# EAGLE schematic ViaCar Main (EAGLE 5.11)

## Sheet 1 of 2
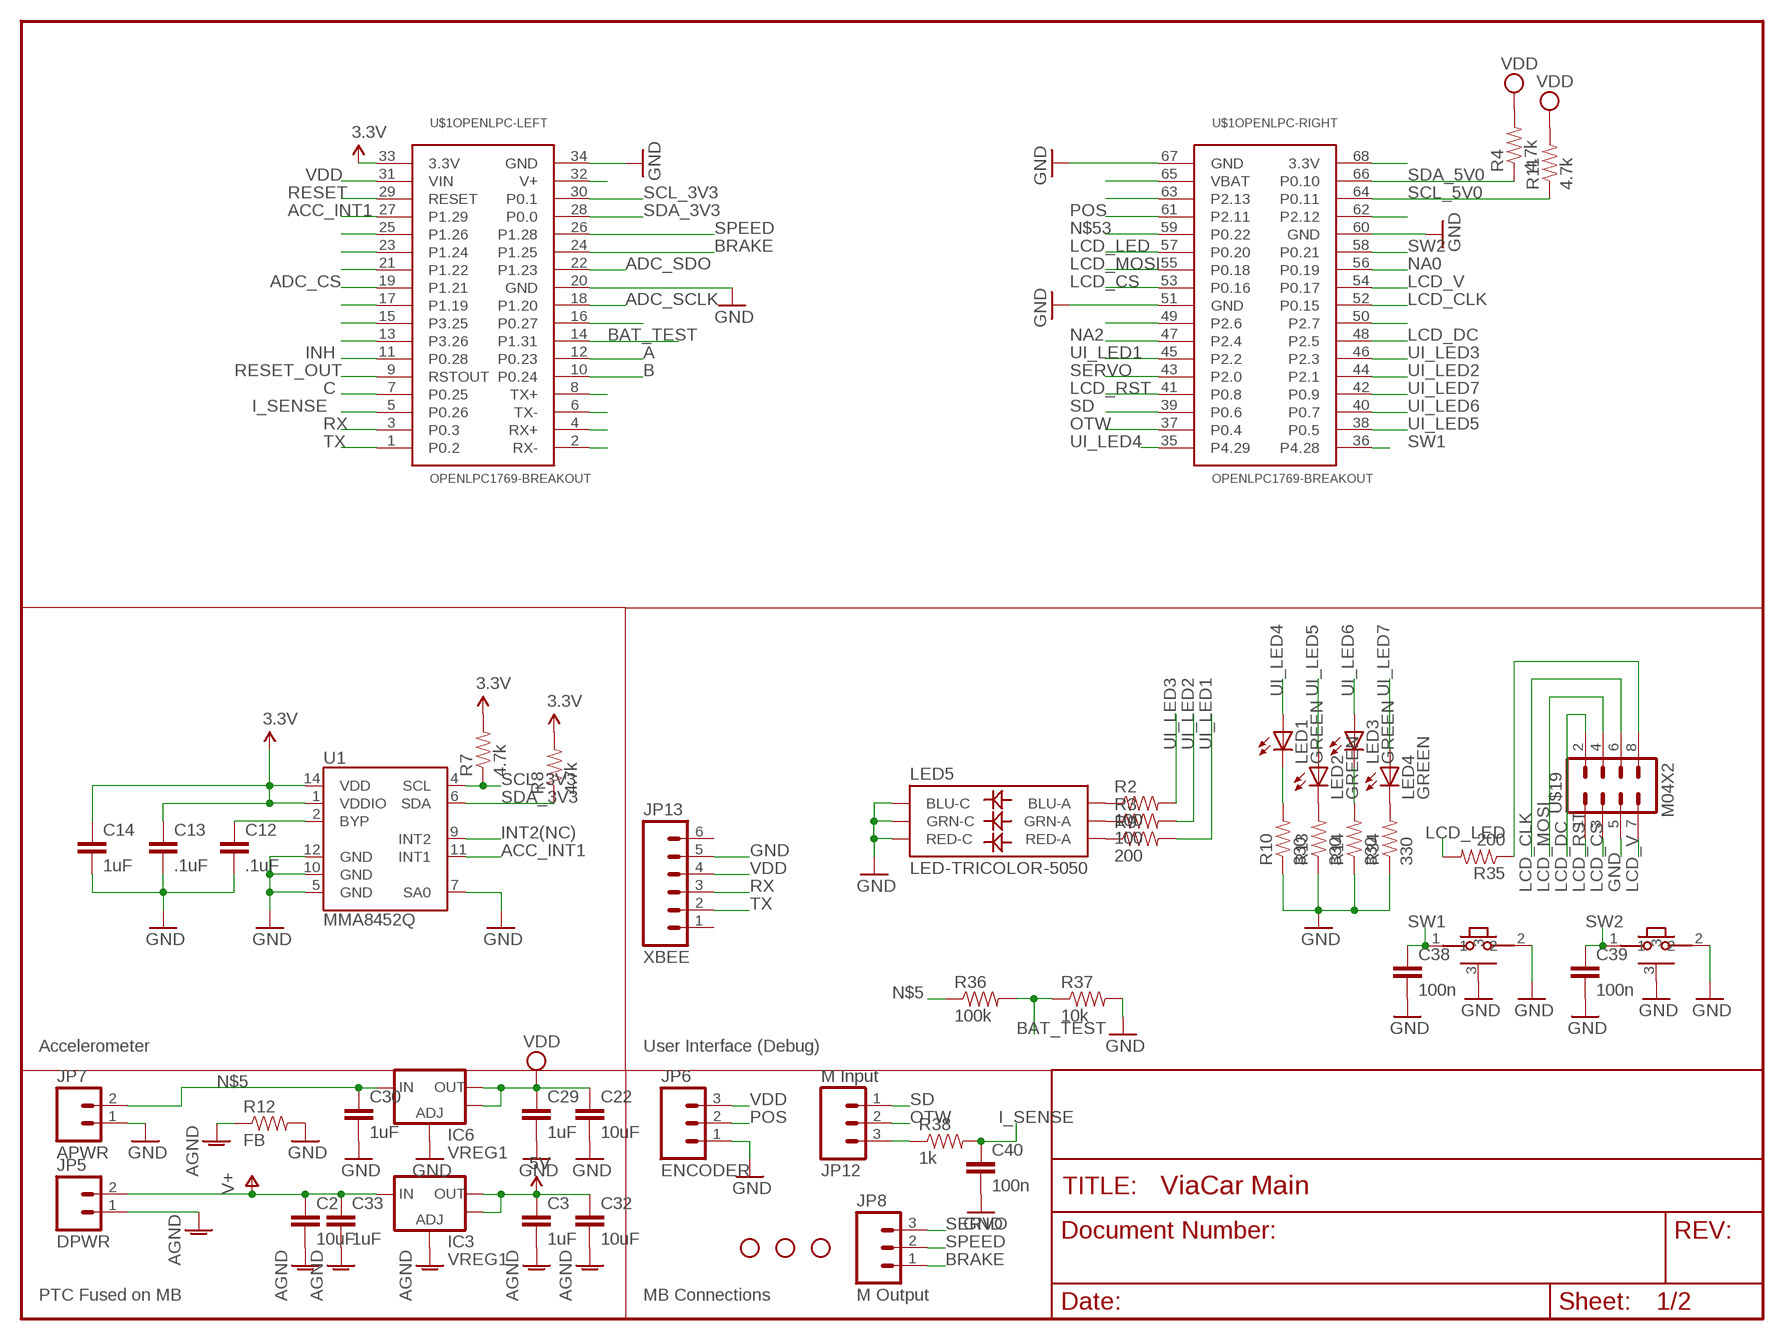
[diagram p0: schematic, sheet 1]

### Parts
C2  10uF  CAP0805  [0805]
C3  1uF  CAP0805  [0805]
C12  .1uF  CAP0603-CAP  [0603-CAP]
C13  .1uF  CAP0603-CAP  [0603-CAP]
C14  1uF  CAP0805  [0805]
C22  10uF  CAP1206  [1206]
C29  1uF  CAP0805  [0805]
C30  1uF  CAP0805  [0805]
C32  10uF  CAP1206  [1206]
C33  1uF  CAP1206  [1206]
C38  100n  CAP0603-CAP  [0603-CAP]
C39  100n  CAP0603-CAP  [0603-CAP]
C40  100n  CAP0603-CAP  [0603-CAP]
IC3  VREG1  V_REG_LM1117SOT223  [SOT223]
IC6  VREG1  V_REG_LM1117SOT223  [SOT223]
JP5  DPWR  M02POLAR  [MOLEX-1X2]
JP6  ENCODER  M03POLAR  [MOLEX-1X3]
JP7  APWR  M02POLAR  [MOLEX-1X2]
JP8  M Output  M03POLAR  [MOLEX-1X3]
JP10  STAND-OFF  [STAND-OFF]
JP11  STAND-OFF  [STAND-OFF]
JP12  M Input  M03POLAR  [MOLEX-1X3]
JP13  XBEE  M06SIP  [1X06]
JP14  STAND-OFF  [STAND-OFF]
LED1  GREEN  LED0603  [LED-0603]
LED2  GREEN  LED0603  [LED-0603]
LED3  GREEN  LED0603  [LED-0603]
LED4  GREEN  LED0603  [LED-0603]
LED5  LED-TRICOLOR-5050  [LED-TRICOLOR-5050]
R2  100  RESISTOR0603-RES  [0603-RES]
R3  100  RESISTOR0603-RES  [0603-RES]
R4  4.7k  RESISTOR0603-RES  [0603-RES]
R7  4.7k  RESISTOR0603-RES  [0603-RES]
R8  4.7k  RESISTOR0603-RES  [0603-RES]
R9  200  RESISTOR0603-RES  [0603-RES]
R10  330  RESISTOR0603-RES  [0603-RES]
R11  4.7k  RESISTOR0603-RES  [0603-RES]
R12  FB  RESISTOR0603-RES  [0603-RES]
R13  330  RESISTOR0603-RES  [0603-RES]
R14  330  RESISTOR0603-RES  [0603-RES]
R34  330  RESISTOR0603-RES  [0603-RES]
R35  200  RESISTOR0603-RES  [0603-RES]
R36  100k  RESISTOR0603-RES  [0603-RES]
R37  10k  RESISTOR0603-RES  [0603-RES]
R38  1k  RESISTOR0603-RES  [0603-RES]
U1  MMA8452Q  [QFN-16_0.5MM]
U$1  OPENLPC1769-BREAKOUT  [OPENLPC1769-BREAKOUT]
U$11  B3U-3100P  [B3U-3100P]
U$12  B3U-3100P  [B3U-3100P]
U$19  M04X2  [2X4]

### Nets
3.3V: C13.1 C14.1 R7.2 R8.2 U1.1(VDDIO) U1.14(VDD) U$1.33(OPENLPC-LEFT:3.3V)
5V: C3.1 C32.1 IC3.2(OUT) IC3.4(OUT) ; also sheet 2
A: U$1.12(OPENLPC-LEFT:P0.23) ; also sheet 2
ACC_INT1: U1.11(INT1) U$1.27(OPENLPC-LEFT:P1.29)
ADC_CS: U$1.19(OPENLPC-LEFT:P1.21) ; also sheet 2
ADC_SCLK: U$1.18(OPENLPC-LEFT:P1.20) ; also sheet 2
ADC_SDO: U$1.22(OPENLPC-LEFT:P1.23) ; also sheet 2
AGND: C2.2 C3.2 C32.2 C33.2 IC3.1(ADJ) JP5.1 R12.1 ; also sheet 2
B: U$1.10(OPENLPC-LEFT:P0.24) ; also sheet 2
BAT_TEST: R36.2 R37.1 U$1.14(OPENLPC-LEFT:P1.31)
BRAKE: JP8.1 U$1.24(OPENLPC-LEFT:P1.25)
C: U$1.7(OPENLPC-LEFT:P0.25) ; also sheet 2
GND: C12.2 C13.2 C14.2 C22.2 C29.2 C30.2 C38.2 C39.2 C40.2 IC6.1(ADJ) JP6.1 JP7.1 JP13.5 LED5.4(BLU-C) LED5.5(RED-C) LED5.6(GRN-C) R10.1 R12.2 R13.1 R14.1 R34.1 R37.2 U1.5(GND) U1.7(SA0) U1.10(GND) U1.12(GND) U$1.20(OPENLPC-LEFT:GND) U$1.34(OPENLPC-LEFT:GND) U$1.51(OPENLPC-RIGHT:GND) U$1.60(OPENLPC-RIGHT:GND) U$1.67(OPENLPC-RIGHT:GND) U$11.2 U$11.3 U$12.2 U$12.3 U$19.5
I_SENSE: C40.1 R38.2 U$1.5(OPENLPC-LEFT:P0.26)
INH: U$1.11(OPENLPC-LEFT:P0.28) ; also sheet 2
INT2(NC): U1.9(INT2)
LCD_CLK: U$1.52(OPENLPC-RIGHT:P0.15) U$19.6
LCD_CS: U$1.53(OPENLPC-RIGHT:P0.16) U$19.3
LCD_DC: U$1.48(OPENLPC-RIGHT:P2.5) U$19.2
LCD_LED: R35.2 U$1.57(OPENLPC-RIGHT:P0.20)
LCD_MOSI: U$1.55(OPENLPC-RIGHT:P0.18) U$19.4
LCD_RST: U$1.41(OPENLPC-RIGHT:P0.8) U$19.1
LCD_V: U$1.54(OPENLPC-RIGHT:P0.17) U$19.7
N$1: U$1.68(OPENLPC-RIGHT:3.3V)
N$3: LED5.3(BLU-A) R2.1
N$4: LED5.1(GRN-A) R3.1
N$5: C30.1 IC6.3(IN) JP7.2 R36.1
N$6: LED5.2(RED-A) R9.1
N$7: JP12.3 R38.1
N$8: LED1.C R10.2
N$14: LED2.C R13.2
N$15: C12.1 U1.2(BYP)
N$16: LED3.C R14.2
N$17: LED4.C R34.2
N$24: R35.1 U$19.8
N$37: U$1.49(OPENLPC-RIGHT:P2.6)
N$42: U$1.50(OPENLPC-RIGHT:P2.7)
N$47: U$1.62(OPENLPC-RIGHT:P2.12)
N$50: U$1.65(OPENLPC-RIGHT:VBAT)
N$51: U$1.63(OPENLPC-RIGHT:P2.13)
N$53: U$1.59(OPENLPC-RIGHT:P0.22)
N$59: U$1.25(OPENLPC-LEFT:P1.26)
N$60: U$1.23(OPENLPC-LEFT:P1.24)
N$61: U$1.21(OPENLPC-LEFT:P1.22)
N$63: U$1.17(OPENLPC-LEFT:P1.19)
N$64: U$1.15(OPENLPC-LEFT:P3.25)
N$65: U$1.13(OPENLPC-LEFT:P3.26)
N$72: U$1.2(OPENLPC-LEFT:RX-)
N$73: U$1.4(OPENLPC-LEFT:RX+)
N$74: U$1.6(OPENLPC-LEFT:TX-)
N$75: U$1.8(OPENLPC-LEFT:TX+)
N$79: U$1.16(OPENLPC-LEFT:P0.27)
N$86: U$1.32(OPENLPC-LEFT:V+)
NA0: U$1.56(OPENLPC-RIGHT:P0.19)
NA2: U$1.47(OPENLPC-RIGHT:P2.4)
OTW: JP12.2 U$1.37(OPENLPC-RIGHT:P0.4)
POS: JP6.2 U$1.61(OPENLPC-RIGHT:P2.11)
RESET: U$1.29(OPENLPC-LEFT:RESET)
RESET_OUT: U$1.9(OPENLPC-LEFT:RSTOUT)
RX: JP13.3 U$1.3(OPENLPC-LEFT:P0.3)
SCL_3V3: R7.1 U1.4(SCL) U$1.30(OPENLPC-LEFT:P0.1)
SCL_5V0: R11.1 U$1.64(OPENLPC-RIGHT:P0.11) ; also sheet 2
SD: JP12.1 U$1.39(OPENLPC-RIGHT:P0.6)
SDA_3V3: R8.1 U1.6(SDA) U$1.28(OPENLPC-LEFT:P0.0)
SDA_5V0: R4.1 U$1.66(OPENLPC-RIGHT:P0.10) ; also sheet 2
SERVO: JP8.3 U$1.43(OPENLPC-RIGHT:P2.0)
SPEED: JP8.2 U$1.26(OPENLPC-LEFT:P1.28)
SW1: C38.1 U$1.36(OPENLPC-RIGHT:P4.28) U$11.1
SW2: C39.1 U$1.58(OPENLPC-RIGHT:P0.21) U$12.1
TX: JP13.2 U$1.1(OPENLPC-LEFT:P0.2)
UI_LED1: R9.2 U$1.45(OPENLPC-RIGHT:P2.2)
UI_LED2: R3.2 U$1.44(OPENLPC-RIGHT:P2.1)
UI_LED3: R2.2 U$1.46(OPENLPC-RIGHT:P2.3)
UI_LED4: LED1.A U$1.35(OPENLPC-RIGHT:P4.29)
UI_LED5: LED2.A U$1.38(OPENLPC-RIGHT:P0.5)
UI_LED6: LED3.A U$1.40(OPENLPC-RIGHT:P0.7)
UI_LED7: LED4.A U$1.42(OPENLPC-RIGHT:P0.9)
V+: C2.1 C33.1 IC3.3(IN) JP5.2 ; also sheet 2
VDD: C22.1 C29.1 IC6.2(OUT) IC6.4(OUT) JP6.3 JP13.4 R4.2 R11.2 U$1.31(OPENLPC-LEFT:VIN)
Unconnected: JP13.1 JP13.6

### Notes on the sheet
- Accelerometer | User Interface (Debug)
- PTC Fused on MB | MB Connections

## Sheet 2 of 2
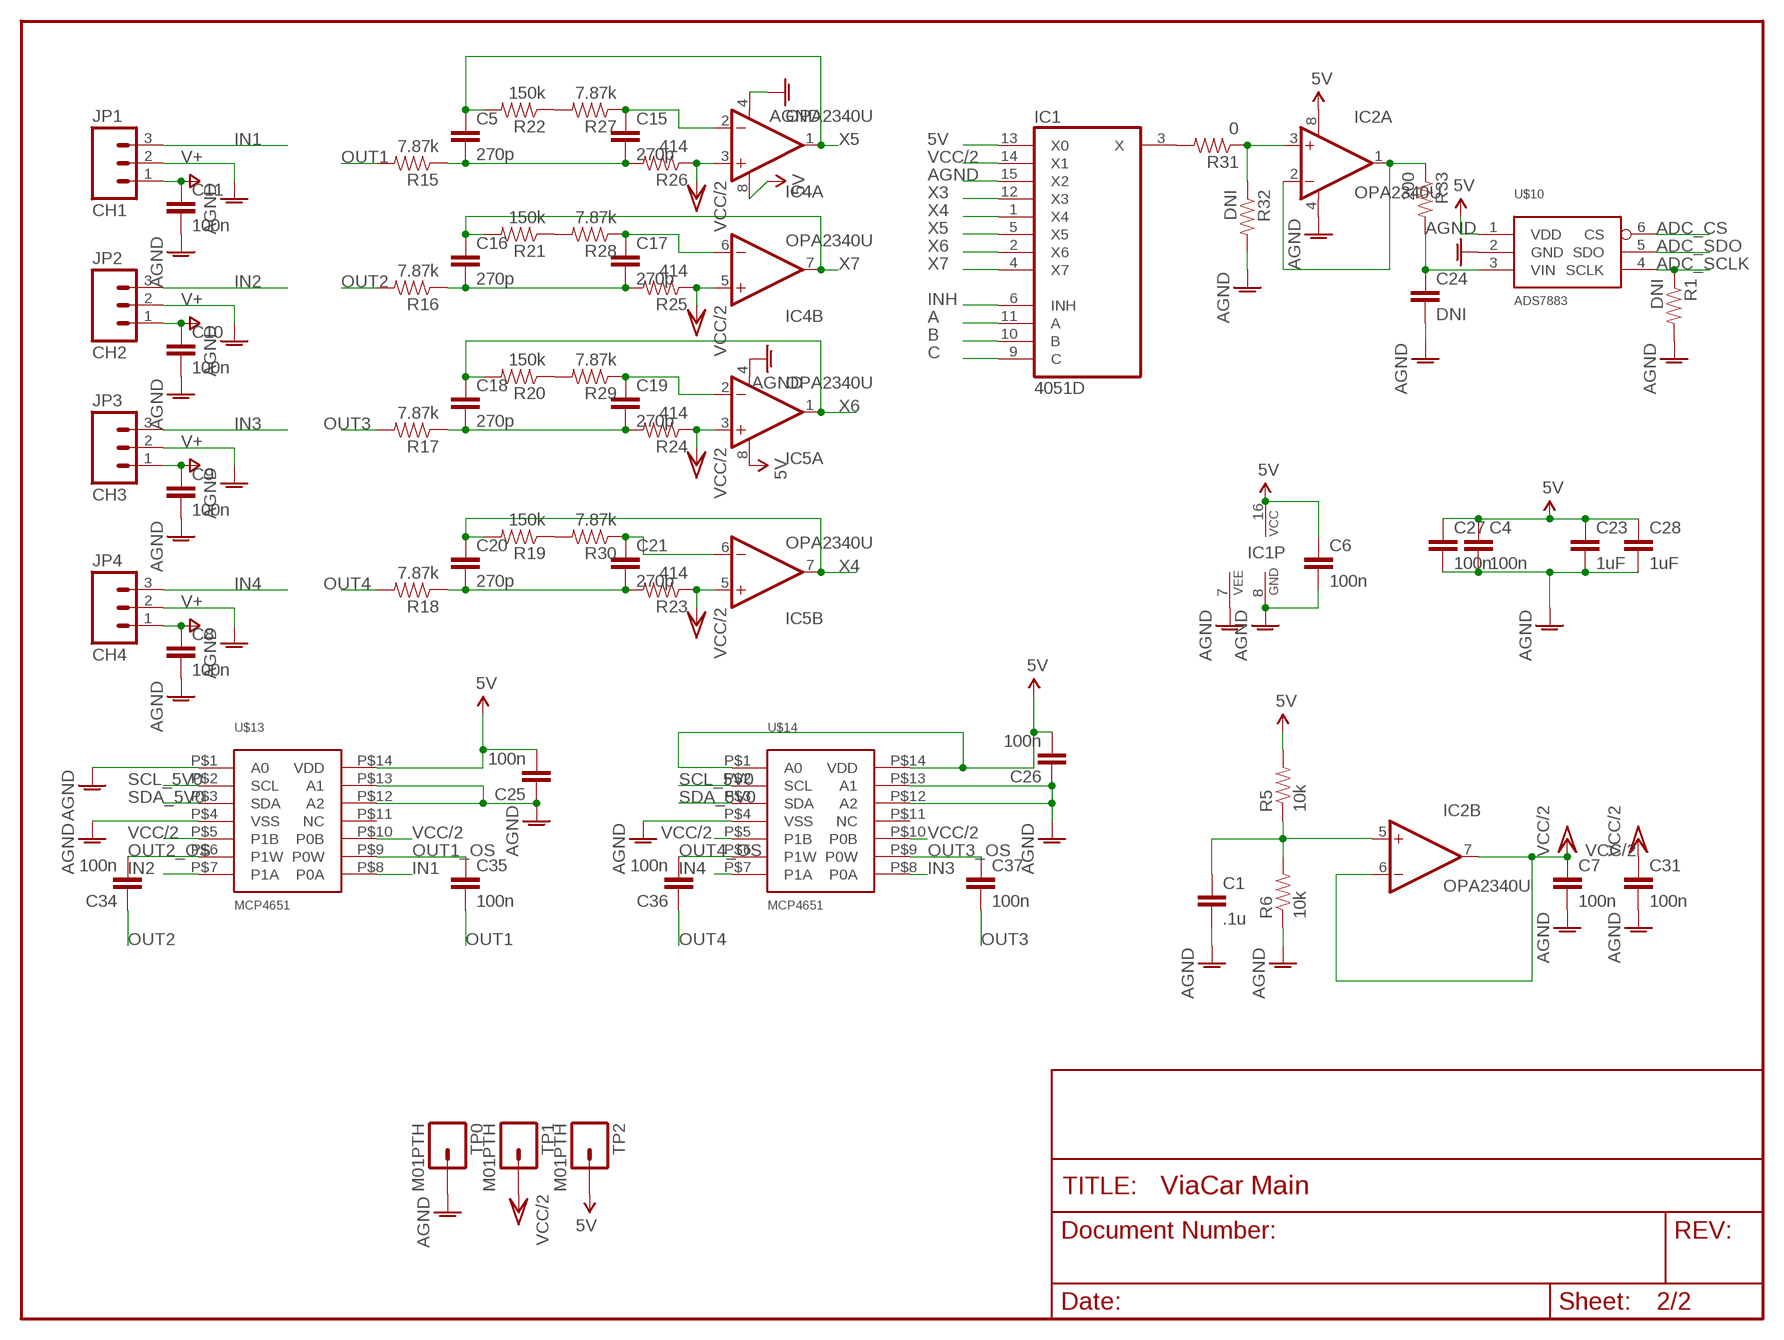
[diagram p1: schematic, sheet 2]

### Parts
C1  .1u  CAP0603-CAP  [0603-CAP]
C4  100n  CAP0603-CAP  [0603-CAP]
C5  270p  CAP0603-CAP  [0603-CAP]
C6  100n  CAP0603-CAP  [0603-CAP]
C7  100n  CAP0603-CAP  [0603-CAP]
C8  100n  CAP0603-CAP  [0603-CAP]
C9  100n  CAP0603-CAP  [0603-CAP]
C10  100n  CAP0603-CAP  [0603-CAP]
C11  100n  CAP0603-CAP  [0603-CAP]
C15  270p  CAP0603-CAP  [0603-CAP]
C16  270p  CAP0603-CAP  [0603-CAP]
C17  270p  CAP0603-CAP  [0603-CAP]
C18  270p  CAP0603-CAP  [0603-CAP]
C19  270p  CAP0603-CAP  [0603-CAP]
C20  270p  CAP0603-CAP  [0603-CAP]
C21  270p  CAP0603-CAP  [0603-CAP]
C23  1uF  CAP0805  [0805]
C24  DNI  CAP0603-CAP  [0603-CAP]
C25  100n  CAP0603-CAP  [0603-CAP]
C26  100n  CAP0603-CAP  [0603-CAP]
C27  100n  CAP0603-CAP  [0603-CAP]
C28  1uF  CAP0805  [0805]
C31  100n  CAP0603-CAP  [0603-CAP]
C34  100n  CAP0603-CAP  [0603-CAP]
C35  100n  CAP0603-CAP  [0603-CAP]
C36  100n  CAP0603-CAP  [0603-CAP]
C37  100n  CAP0603-CAP  [0603-CAP]
IC1  4051D  [SO16]
IC2  OPA2340U  [SO08]
IC4  OPA2340U  [SO08]
IC5  OPA2340U  [SO08]
JP1  CH1  M03POLAR  [MOLEX-1X3]
JP2  CH2  M03POLAR  [MOLEX-1X3]
JP3  CH3  M03POLAR  [MOLEX-1X3]
JP4  CH4  M03POLAR  [MOLEX-1X3]
R1  DNI  RESISTOR0603-RES  [0603-RES]
R5  10k  RESISTOR0603-RES  [0603-RES]
R6  10k  RESISTOR0603-RES  [0603-RES]
R15  7.87k  RESISTOR0603-RES  [0603-RES]
R16  7.87k  RESISTOR0603-RES  [0603-RES]
R17  7.87k  RESISTOR0603-RES  [0603-RES]
R18  7.87k  RESISTOR0603-RES  [0603-RES]
R19  150k  RESISTOR0603-RES  [0603-RES]
R20  150k  RESISTOR0603-RES  [0603-RES]
R21  150k  RESISTOR0603-RES  [0603-RES]
R22  150k  RESISTOR0603-RES  [0603-RES]
R23  414  RESISTOR0603-RES  [0603-RES]
R24  414  RESISTOR0603-RES  [0603-RES]
R25  414  RESISTOR0603-RES  [0603-RES]
R26  414  RESISTOR0603-RES  [0603-RES]
R27  7.87k  RESISTOR0603-RES  [0603-RES]
R28  7.87k  RESISTOR0603-RES  [0603-RES]
R29  7.87k  RESISTOR0603-RES  [0603-RES]
R30  7.87k  RESISTOR0603-RES  [0603-RES]
R31  0  RESISTOR0603-RES  [0603-RES]
R32  DNI  RESISTOR0603-RES  [0603-RES]
R33  200  RESISTOR0603-RES  [0603-RES]
TP0  M01PTH  [1X01]
TP1  M01PTH  [1X01]
TP2  M01PTH  [1X01]
U$10  ADS7883  [SOT-23-6]
U$13  MCP4651  [MCP-TSSOP-14]
U$14  MCP4651  [MCP-TSSOP-14]

### Nets
5V: C4.1 C6.1 C23.1 C25.2 C26.2 C27.1 C28.1 IC1.13(X0) IC1.16(VCC) IC2.8(A:V+) IC4.8(A:V+) IC5.8(A:V+) R5.2 TP2.1 U$10.1(VDD) U$13.P$14(VDD) U$14.P$1(A0) U$14.P$14(VDD) ; also sheet 1
A: IC1.11(A) ; also sheet 1
ADC_CS: U$10.6(CS) ; also sheet 1
ADC_SCLK: R1.1 U$10.4(SCLK) ; also sheet 1
ADC_SDO: U$10.5(SDO) ; also sheet 1
AGND: C1.2 C4.2 C6.2 C7.2 C8.2 C9.2 C10.2 C11.2 C23.2 C24.2 C25.1 C26.1 C27.2 C28.2 C31.2 IC1.7(VEE) IC1.8(GND) IC1.15(X2) IC2.4(A:V-) IC4.4(A:V-) IC5.4(A:V-) JP1.2 JP2.2 JP3.2 JP4.2 R1.2 R6.1 R32.2 TP0.1 U$10.2(GND) U$13.P$1(A0) U$13.P$4(VSS) U$13.P$12(A2) U$13.P$13(A1) U$14.P$4(VSS) U$14.P$12(A2) U$14.P$13(A1) ; also sheet 1
B: IC1.10(B) ; also sheet 1
C: IC1.9(C) ; also sheet 1
IN1: JP1.3 U$13.P$8(P0A)
IN2: JP2.3 U$13.P$7(P1A)
IN3: JP3.3 U$14.P$8(P0A)
IN4: JP4.3 U$14.P$7(P1A)
INH: IC1.6(INH) ; also sheet 1
N$2: IC2.3(A:+IN) R31.1 R32.1
N$10: C1.1 IC2.5(B:+IN) R5.1 R6.2
N$20: C15.1 IC4.2(A:-IN) R27.1
N$21: C5.2 C15.2 R15.1 R26.2
N$22: C16.2 C17.2 R16.1 R25.2
N$23: C17.1 IC4.6(B:-IN) R28.1
N$25: C18.2 C19.2 R17.1 R24.2
N$27: C19.1 IC5.2(A:-IN) R29.1
N$28: C20.2 C21.2 R18.1 R23.2
N$29: C21.1 IC5.6(B:-IN) R30.1
N$31: IC1.3(X) R31.2
N$32: IC2.1(A:OUT) IC2.2(A:-IN) R33.1
N$33: R22.1 R27.2
N$34: R21.1 R28.2
N$35: R20.1 R29.2
N$36: R19.1 R30.2
N$38: C24.1 R33.2 U$10.3(VIN)
OUT1: C35.2 R15.2
OUT1_OS: C35.1 U$13.P$9(P0W)
OUT2: C34.1 R16.2
OUT2_OS: C34.2 U$13.P$6(P1W)
OUT3: C37.2 R17.2
OUT3_OS: C37.1 U$14.P$9(P0W)
OUT4: C36.1 R18.2
OUT4_OS: C36.2 U$14.P$6(P1W)
SCL_5V0: U$13.P$2(SCL) U$14.P$2(SCL) ; also sheet 1
SDA_5V0: U$13.P$3(SDA) U$14.P$3(SDA) ; also sheet 1
V+: C8.1 C9.1 C10.1 C11.1 JP1.1 JP2.1 JP3.1 JP4.1 ; also sheet 1
VCC/2: C7.1 C31.1 IC1.14(X1) IC2.6(B:-IN) IC2.7(B:OUT) IC4.3(A:+IN) IC4.5(B:+IN) IC5.3(A:+IN) IC5.5(B:+IN) R23.1 R24.1 R25.1 R26.1 TP1.1 U$13.P$5(P1B) U$13.P$10(P0B) U$14.P$5(P1B) U$14.P$10(P0B)
X3: IC1.12(X3)
X4: C20.1 IC1.1(X4) IC5.7(B:OUT) R19.2
X5: C5.1 IC1.5(X5) IC4.1(A:OUT) R22.2
X6: C18.1 IC1.2(X6) IC5.1(A:OUT) R20.2
X7: C16.1 IC1.4(X7) IC4.7(B:OUT) R21.2
Unconnected: U$13.P$11(NC) U$14.P$11(NC)

## Library data of the parts
C1-C40 = SparkFun:CAP: Capacitor Standard 0603 ceramic capacitor, and 0.1" leaded capacitor.
IC1 = 40xx:4051: 8-channel ANALOG MULTIPLEXER
IC2 IC4 IC5 = burr-brown:OPA2340: Single-Supply, Rail-to-Rail Operational Amplifiers MicroAmplifier(TM) Series; Product Folder:OPA2340; MF: TEXAS INSTRUMENTS; MPN: OPA2340UA; OC_FARNELL: 1101541; OC_NEWARK: 36K7581
IC3 IC6 = SparkFun:V_REG_LM1117: Voltage Regulator LM1117 Standard adjustable voltage regulator but in SMD form. Spark Fun Electronics SKU : COM-00595
JP1-JP4 JP6 JP8 JP12 = SparkFun:M03: Header 3 Standard 3-pin 0.1" header. Use with straight break away headers (SKU : PRT-00116), right angle break away headers (PRT-00553), swiss pins (PRT-00743), machine pins (PRT-00117), and female headers (PRT-00115). Molex polarized connector foot print use with SKU : PRT-08232 with associated crimp pins and housings.
JP5 JP7 = SparkFun:M02: Header 2 Standard 2-pin 0.1" header. Use with straight break away headers (SKU : PRT-00116), right angle break away headers (PRT-00553), swiss pins (PRT-00743), machine pins (PRT-00117), and female headers (PRT-00115). Molex polarized connector foot print use with SKU : PRT-08233 with associated crimp pins and housings.
JP10 JP11 JP14 = SparkFun:STAND-OFF: Stand Off This is the mechanical footprint for a #4 phillips button head screw. Use the keepout ring to avoid running the screw head into surrounding components. SKU : PRT-00447
JP13 = SparkFun:M06: Header 6 Standard 6-pin 0.1" header. Use with straight break away headers (SKU : PRT-00116), right angle break away headers (PRT-00553), swiss pins (PRT-00743), machine pins (PRT-00117), and female headers (PRT-00115). Molex polarized connector foot print use with SKU : PRT-08094 with associated crimp pins and housings. NOTES ON THE VARIANTS LOCK and LOCK_LONGPADS... This footprint was designed to help hold the alignment of a through-hole component (i.e. 6-pin header) while soldering it into place. You may notice that each hole has been shifted either up or down by 0.005 of an inch from it's more standard position (which is a perfectly straight line). This slight alteration caused the pins (the squares in the middle) to touch the edges of the holes. Because they are alternating, it causes a "brace" to hold the component in place. 0.005 has proven to be the perfect amount of "off-center" position when using our standard breakaway headers. Although looks a little odd when you look at the bare footprint, once you have a header in there, the alteration is very hard to notice. Also, if you push a header all the way into place, it is covered up entirely on the bottom side. This idea of altering the position of holes to aid alignment will be further integrated into the Sparkfun Library for other footprints. It can help hold any component with 3 or more connection pins.
LED1-LED4 = SparkFun:LED: LEDs Standard schematic elements and footprints for 5mm, 3mm, 1206, and 0603 sized LEDs. 5mm - Spark Fun Electronics SKU : COM-00529 (and others)
LED5 = SparkFun:LED-TRICOLOR-5050
R1-R38 = SparkFun:RESISTOR: Resistor Basic schematic elements and footprints for 0603, 1206, and PTH resistors.
TP0 TP1 TP2 = SparkFun:M01: Header 1 Standard 1-pin 0.1" header. Use with straight break away headers (SKU : PRT-00116), right angle break away headers (PRT-00553), swiss pins (PRT-00743), machine pins (PRT-00117), and female headers (PRT-00115).
U1 = SparkFun:MMA8452Q: MMA8452Q 3-Axis, 12/8-bit Digital Accelerometer Supply Voltage: 1.6-3.6V Range: +/- 2g, 4g, 8g Interface: I2C, 12-bit and 8-bit ODR: 1.56 Hz - 800 Hz Package: QFN-16 http://cache.freescale.com/files/sensors/doc/data_sheet/MMA8452Q.pdf
U$1 = OpenLPC:OPENLPC1769-BREAKOUT: OpenLPC1769 Breakout : Part for the OpenLPC1769 development board. Uses standard .1" headers and restrictions where the reset/usb/jumper parts are. Mirrored for insertion on the top layer of the board with male headers. Not yet tested on a manufacturd board.
U$10 = William:ADS7883
U$11 U$12 = William:B3U-3100P: B3U-3100P Switch with Ground Terminal Micro switch, Off/Mom, SMD, Right Angle
U$13 U$14 = William:MCP4651: MCP4651 Dual Digital I2C Potentiometer based off of recommended Microchip TSSOP-14 footprint. Untested.
U$19 = SparkFun:M04X2